# Altium schematic sheet [3] ADC.SchDoc
size A4
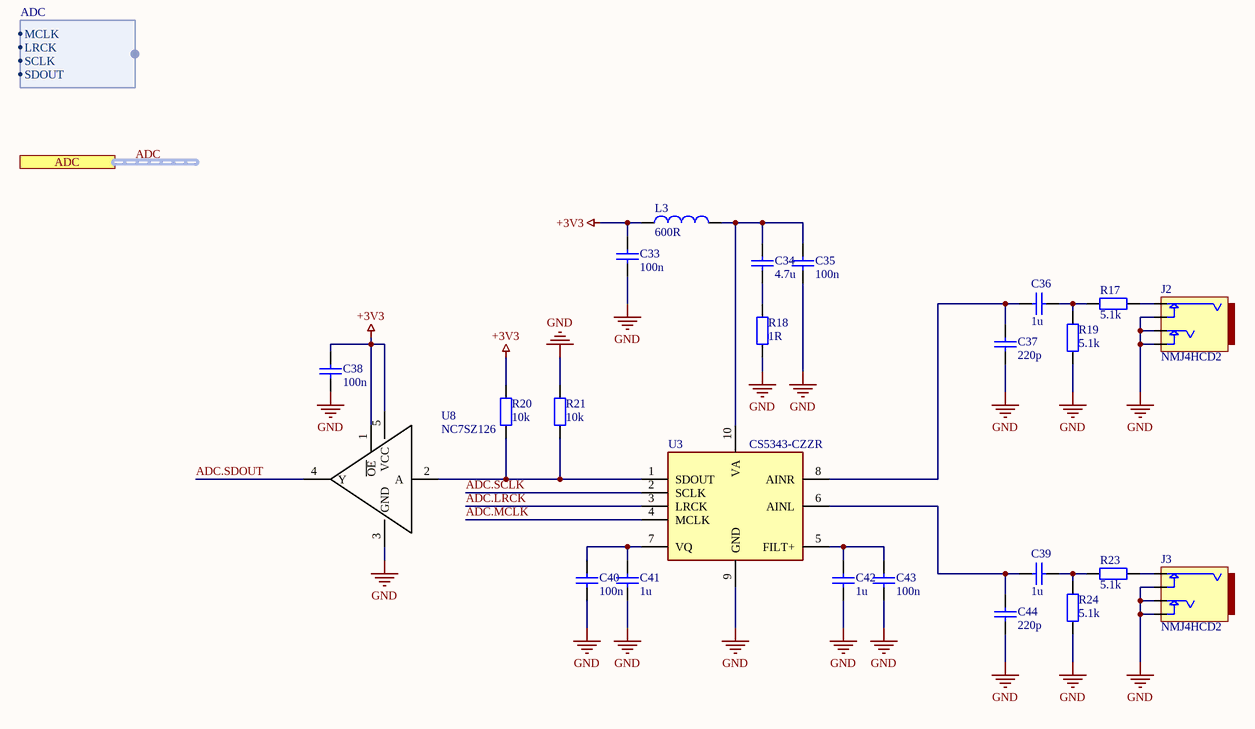
[diagram p0: [3] ADC.SchDoc]

## Parts
C33  100n  [Capacitor 0603]
C34  4.7u  [Capacitor 0603]
C35  100n  [Capacitor 0603]
C36  1u  [Capacitor 0603]
C37  220p  [Capacitor 0603]
C38  100n  [Capacitor 0603]
C39  1u  [Capacitor 0603]
C40  100n  [Capacitor 0603]
C41  1u  [Capacitor 0603]
C42  1u  [Capacitor 0603]
C43  100n  [Capacitor 0603]
C44  220p  [Capacitor 0603]
J2  NMJ4HCD2  [Mechanical NMJ4HCD2]
J3  NMJ4HCD2  [Mechanical NMJ4HCD2]
L3  600R  [Inductor 0603]
R17  5.1k  [Resistor 0603]
R18  1R  [Resistor 0603]
R19  5.1k  [Resistor 0603]
R20  10k  [Resistor 0603]
R21  10k  [Resistor 0603]
R23  5.1k  [Resistor 0603]
R24  5.1k  [Resistor 0603]
U3  CS5343-CZZR  [TSSOP10]
U8  NC7SZ126  [SC70-5]

## Ports
ADC (harness ADC)

## Harnesses
ADC: MCLK, LRCK, SCLK, SDOUT

## Nets
+3V3: C33.2 C38.2 L3.1 R20.2 U8.1(~{OE}) U8.5(VCC)
GND: C33.1 C35.1 C37.1 C38.1 C40.1 C41.1 C42.1 C43.1 C44.1 J2.1(S) J2.2(SN) J2.4(TN) J3.1(S) J3.2(SN) J3.4(TN) R18.1 R19.1 R21.2 R24.1 U3.9(GND) U8.3(GND)
ADC.LRCK: U3.3(LRCK)
ADC.MCLK: U3.4(MCLK)
ADC.SCLK: U3.2(SCLK)
ADC.SDOUT: U8.4(Y)
NetC34_1: C34.1 R18.2
NetC34_2: C34.2 C35.2 L3.2 U3.10(VA)
NetC36_1: C36.1 C37.2 U3.8(AINR)
NetC36_2: C36.2 R17.1 R19.2
NetC39_1: C39.1 C44.2 U3.6(AINL)
NetC39_2: C39.2 R23.1 R24.2
NetC40_2: C40.2 C41.2 U3.7(VQ)
NetC42_2: C42.2 C43.2 U3.5(FILT+)
NetJ2_3: J2.3(T) R17.2
NetJ3_3: J3.3(T) R23.2
NetR20_1: R20.1 R21.1 U3.1(SDOUT) U8.2(A)

## Buses and harness runs
harness ADC = port ADC

## Library data of the parts
C33 C35 C38 C40 C43 = Capacitor 100n 10% 0603 EMK107B7104KA-T: Multilayer Ceramic Capacitors MLCC - SMD/SMT 0603 16VDC 0.1uF 10% X7R; Manufacturer: Taiyo Yuden; Type: SMD; Manufacturer Part Number: EMK107B7104KA-T; Footprint: 0603; Datasheet: https://pl.mouser.com/datasheet/2/396/mlcc02_e-1307760.pdf
C34 = Capacitor 4.7u 10% 0603 EMK107ABJ475KA-T: Multilayer Ceramic Capacitors MLCC - SMD/SMT 0603 16VDC 4.7uF 10% X5R; Manufacturer: Taiyo Yuden; Type: SMD; Manufacturer Part Number: EMK107ABJ475KA-T; Footprint: 0603; Datasheet: https://pl.mouser.com/datasheet/2/396/mlcc02_e-1307760.pdf
C36 C39 C41 C42 = Capacitor 1u 10% 0603 EMK107B7105KA-T: Multilayer Ceramic Capacitors MLCC - SMD/SMT 0603 16VDC 1uF 10% X7R; Manufacturer: Taiyo Yuden; Type: SMD; Manufacturer Part Number: EMK107B7105KA-T; Footprint: 0603; Datasheet: https://pl.mouser.com/datasheet/2/396/mlcc02_e-1307760.pdf
C37 C44 = Capacitor 220p 10% 0603 HMK107SD221KA-T: Multilayer Ceramic Capacitors MLCC - SMD/SMT 0603 100VDC 220pF 20% NPO MID HIGH VOL; Manufacturer: Taiyo Yuden; Type: SMD; Manufacturer Part Number: HMK107SD221KA-T; Footprint: 0603; Datasheet: https://pl.mouser.com/datasheet/2/396/mlcc06_e-1892430.pdf
J2 J3 = Mechanical JACK Phone Connectors 2C MONO 2-SPST NC: Phone Connectors 2C MONO 2-SPST NC; Manufacturer: Neutrik; Manufacturer Part Number: NMJ4HCD2; Footprint: Solder Pin; Type: THT; Datasheet: https://pl.mouser.com/datasheet/2/289/nmj4hcd2-1853956.pdf
L3 = Inductor 600R 1% 0603 HZ0603C601R-10: Ferrite Beads 600ohms 100MHz 300mA Monolithic 0603 SMD; Manufacturer: Laird Performance Materials; Manufacturer Part Number: HZ0603C601R-10; Footprint: 0603; Type: SMD; Datasheet: https://www.mouser.com/catalog/specsheets/Laird_10092020_Laird%20MCP%20Catalog-EMI%20Filtering%20and%20RF%20Inductor%20Sep%202020.pdf
R17 R19 R23 R24 = Resistor 5.1k 1% 0603 RT0603FRE075K1L: Thin Film Resistors - SMD 1/10W 5.1K ohm 1% 50ppm; Manufacturer: Yageo; Manufacturer Part Number: RT0603FRE075K1L; Footprint: 0603; Type: SMD; Datasheet: https://pl.mouser.com/datasheet/2/447/PYu_RT_1_to_0_01_RoHS_L_11-1669912.pdf
R18 = Resistor 1R 1% 0603 RT0603FRE071RL: Thin Film Resistors - SMD 1/10W 1 ohm ohm 50 ppm; Manufacturer: Yageo; Manufacturer Part Number: RT0603FRE071RL; Footprint: 0603; Type: SMD; Datasheet: https://pl.mouser.com/datasheet/2/447/PYu_RT_1_to_0_01_RoHS_L_11-1669912.pdf
R20 R21 = Resistor 10k 1% 0603 RT0603FRE0710KL: Thin Film Resistors - SMD 10K ohm 1% 1/10W; Manufacturer: Yageo; Manufacturer Part Number: RT0603FRE0710KL; Footprint: 0603; Type: SMD; Datasheet: https://pl.mouser.com/datasheet/2/447/PYu_RT_1_to_0_01_RoHS_L_11-1669912.pdf
U3 = IC Audio A/D Converter ICs IC 98dB 24-bit 96kHz Stereo ADC CS5343-CZZR: Audio A/D Converter ICs IC 98dB 24-bit 96kHz Stereo ADC; Manufacturer: Cirrus Logic; Manufacturer Part Number: CS5343-CZZR; Footprint: TSSOP-10; Type: SMD; Datasheet: https://pl.mouser.com/datasheet/2/76/CS5343_44_F5-1142054.pdf
U8 = IC Buffers & Line Drivers UHS Buffer NC7SZ126P5X: Buffers & Line Drivers UHS Buffer; Manufacturer: ON Semiconductor / Fairchild; Manufacturer Part Number: NC7SZ126; Footprint: SC-70-5; Type: SMD; Datasheet: https://pl.mouser.com/datasheet/2/308/NC7SZ126-D-1812272.pdf